# EAGLE schematic Schematic_BG96_Mega2560 (EAGLE 9.5.2)
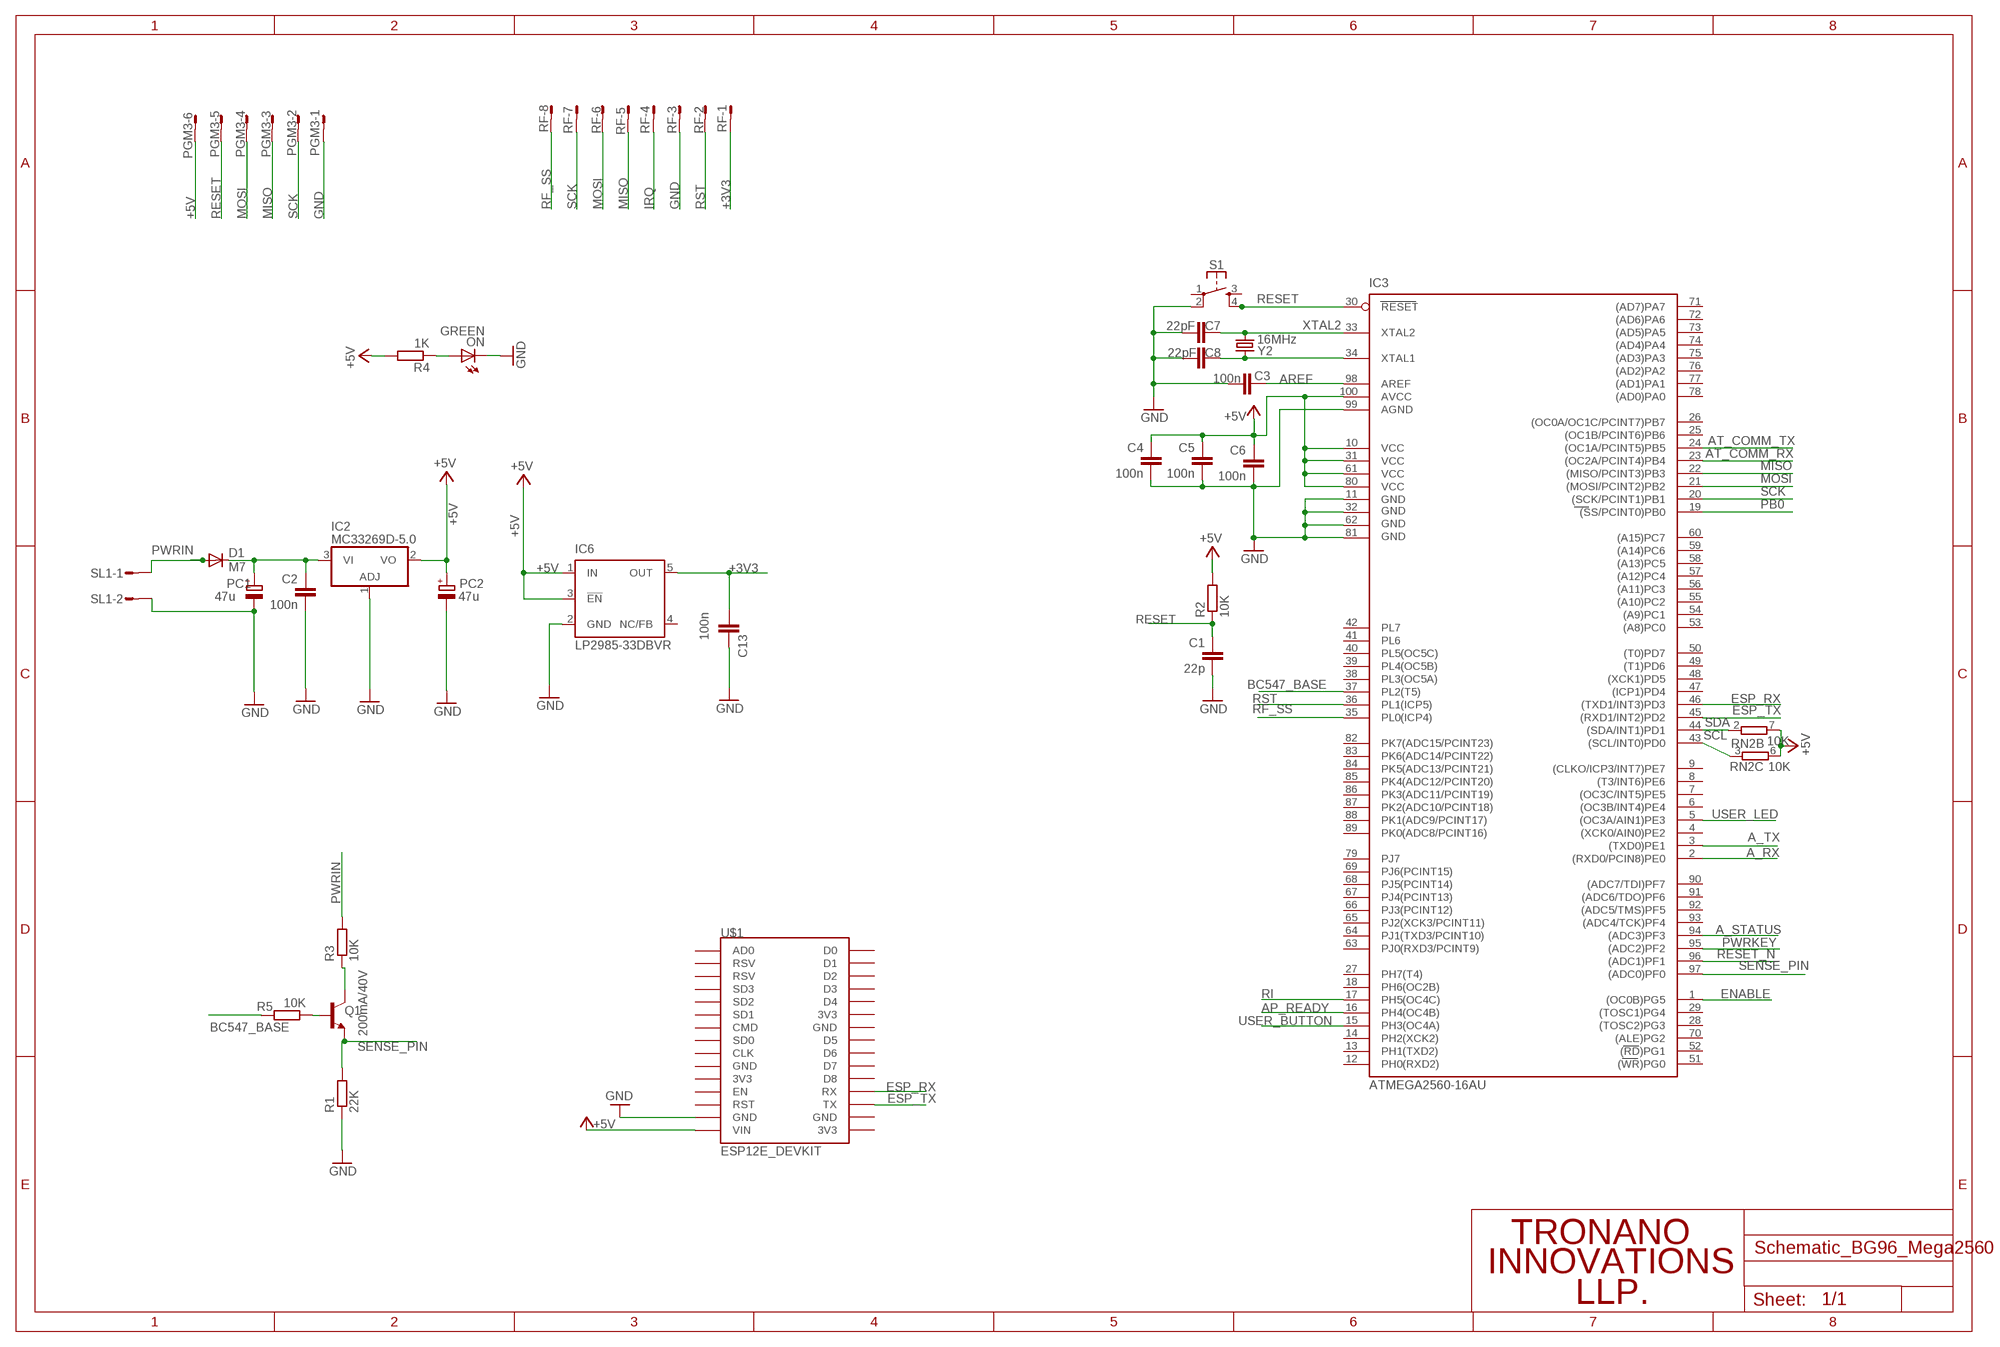
[diagram p0: schematic, sheet 1, part 1 of 2]
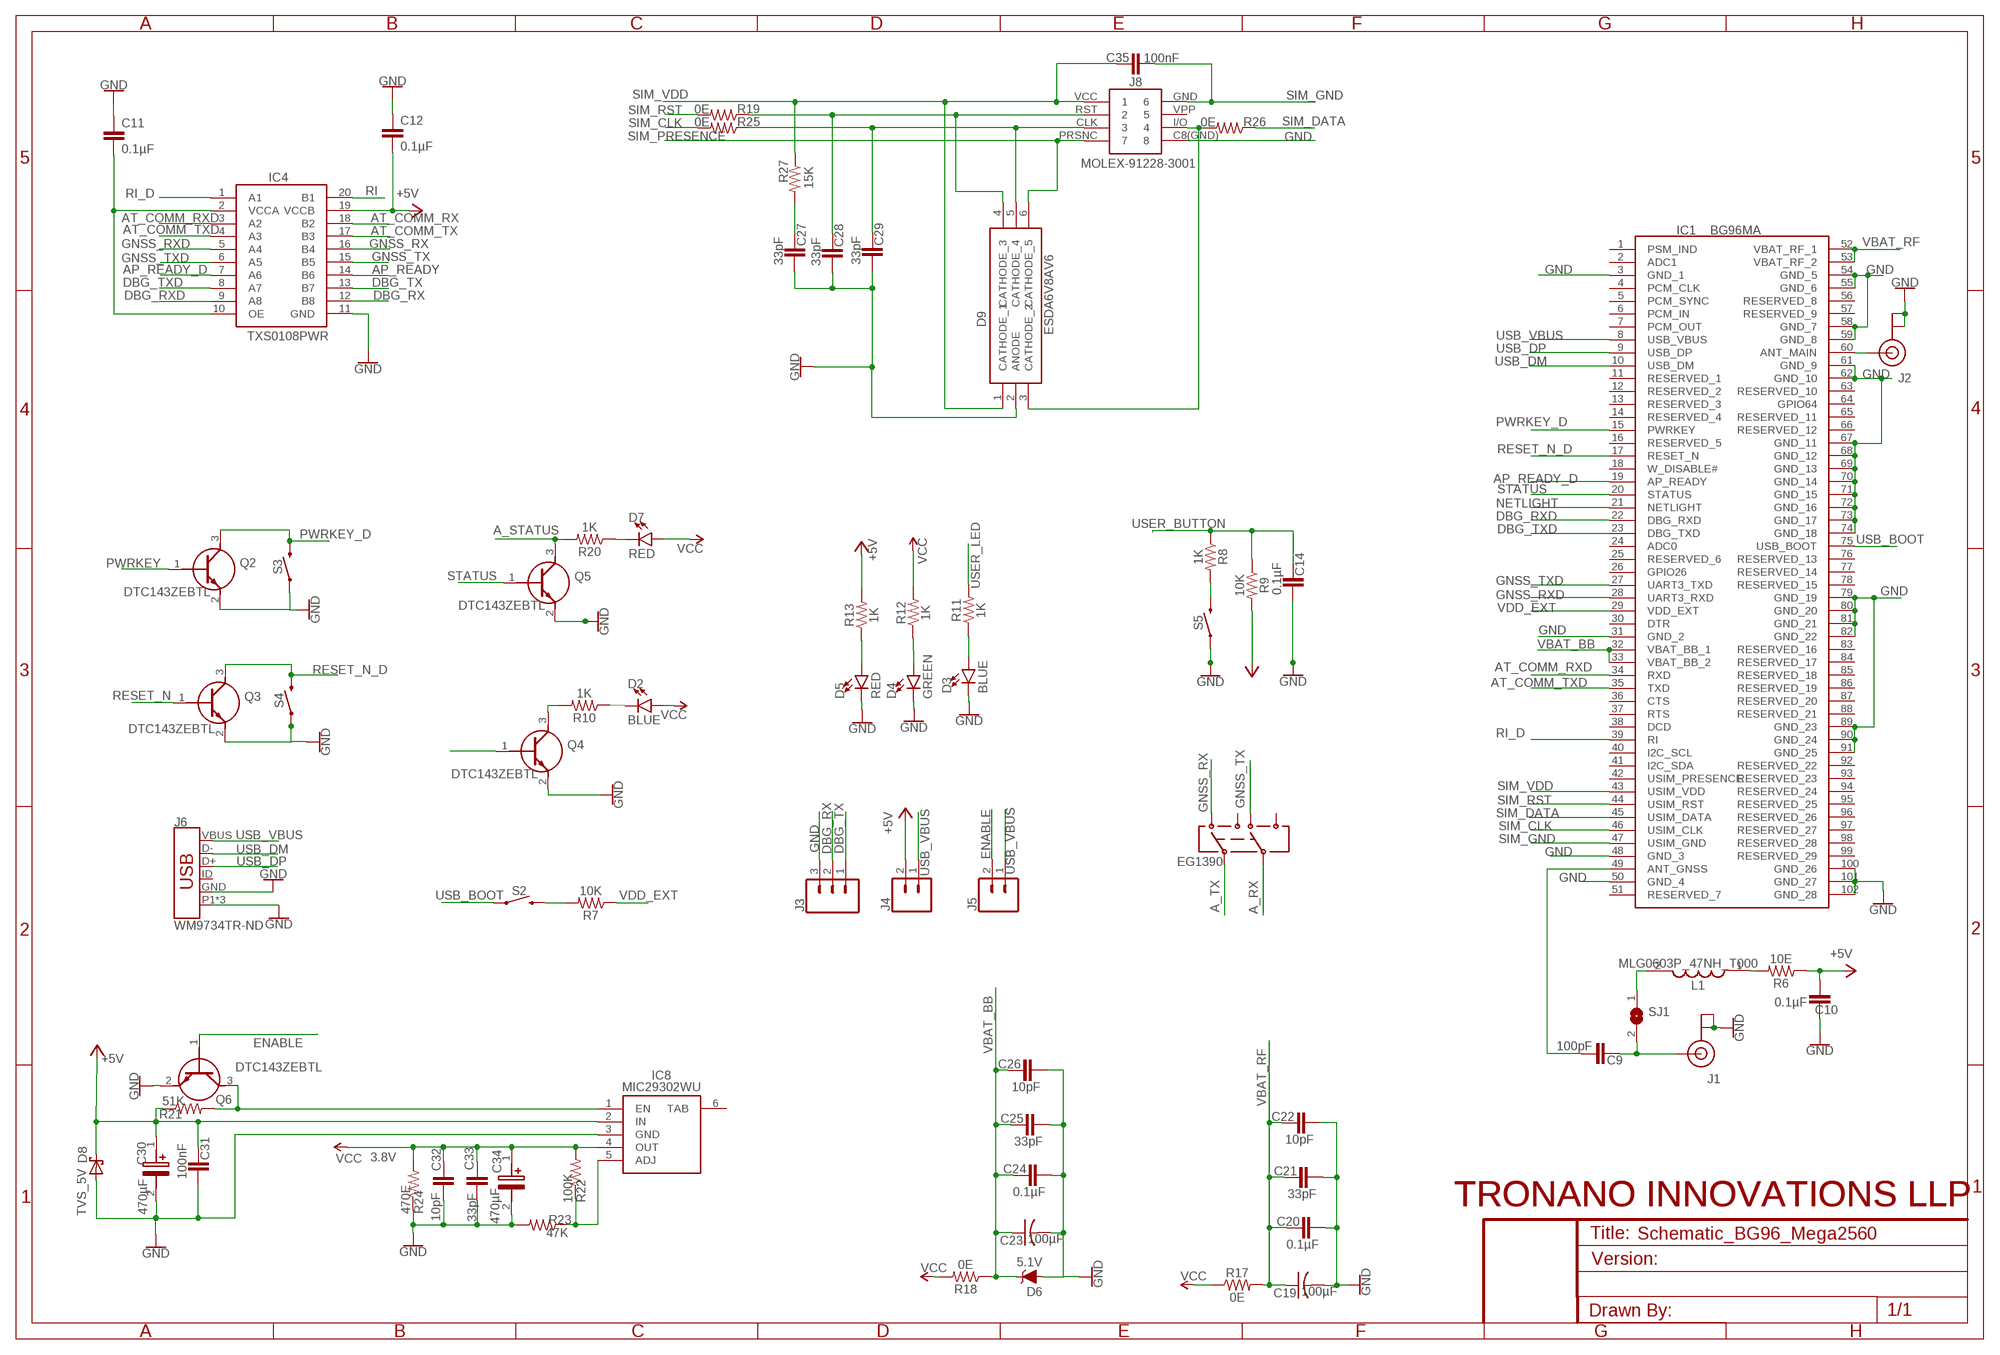
[diagram p1: schematic, sheet 1, part 2 of 2]

## Parts
C1  22p  C-EUC0805  [C0805]
C2  100n  C-EUC0805  [C0805]
C3  100n  C-EUC0805  [C0805]
C4  100n  C-EUC0805  [C0805]
C5  100n  C-EUC0805  [C0805]
C6  100n  C-EUC0805  [C0805]
C7  22pF  C-EUC0805  [C0805]
C8  22pF  C-EUC0805  [C0805]
C9  100pF  0.33UF/330NF-0805-50V-10%  [0805]
C10  0.1µF  0.33UF/330NF-0805-50V-10%  [0805]
C11  0.1µF  0.33UF/330NF-0805-50V-10%  [0805]
C12  0.1µF  0.33UF/330NF-0805-50V-10%  [0805]
C13  100n  C-EUC0805  [C0805]
C14  0.1µF  0.33UF/330NF-0805-50V-10%  [0805]
C19  100µF  C-USC0805K  [C0805K]
C20  0.1µF  0.33UF/330NF-0805-50V-10%  [0805]
C21  33pF  0.33UF/330NF-0805-50V-10%  [0805]
C22  10pF  0.33UF/330NF-0805-50V-10%  [0805]
C23  100µF  C-USC0805K  [C0805K]
C24  0.1µF  0.33UF/330NF-0805-50V-10%  [0805]
C25  33pF  0.33UF/330NF-0805-50V-10%  [0805]
C26  10pF  0.33UF/330NF-0805-50V-10%  [0805]
C27  33pF  0.33UF/330NF-0805-50V-10%  [0805]
C28  33pF  0.33UF/330NF-0805-50V-10%  [0805]
C29  33pF  0.33UF/330NF-0805-50V-10%  [0805]
C30  470µF  T495D477M006ATE0457280  [CAPPM7343X310N]
C31  100nF  0.33UF/330NF-0805-50V-10%  [0805]
C32  10pF  0.33UF/330NF-0805-50V-10%  [0805]
C33  33pF  0.33UF/330NF-0805-50V-10%  [0805]
C34  470µF  T495D477M006ATE0457280  [CAPPM7343X310N]
C35  100nF  0.33UF/330NF-0805-50V-10%  [0805]
D1  M7  DIODE-SMB  [SMB]
D2  BLUE  LED-BLUE1206  [LED-1206]
D3  BLUE  LED-BLUE1206  [LED-1206]
D4  GREEN  LED-BLUE1206  [LED-1206]
D5  RED  LED-BLUE1206  [LED-1206]
D6  5.1V  DIODE-ZENER-MMSZ5232BS  [SOD-323]
D7  RED  LED-BLUE1206  [LED-1206]
D8  TVS_5V  SMF5.0AT1G  [SOD123FL]
D9  ESDA6V8AV6  [SOTFL50P160X60-6N]
EG1390  SWITCH-DPDT-SMD-AYZ0202  [SWITCH_DPDT_SMD_AYZ0202]
IC1  BG96MA  [BG96MA]
IC2  MC33269D-5.0  [DPACK]
IC3  ATMEGA2560-16AU  ATMEGA1280-16AU  [TQFP100]
IC4  TXS0108PWR  TXB0108PWR  [SOP65P640X120-20N]
IC6  LP2985-33DBVR  TPS77033  [SOT23-DBV]
IC8  MIC29302WU  [6-PIN-TO-263]
J1  U.FL  [U.FL]
J2  U.FL  [U.FL]
J3  CONN_03LOCK  [1X03_LOCK]
J4  CONN_02  [1X02]
J5  CONN_02  [1X02]
J6  WM9734TR-ND  USB_MICRO-B_FEMALE-SMT-VERT  [USB-B-MICRO-SMD_VERT]
J8  MOLEX-91228-3001  [MOLEX-912283001]
L1  MLG0603P_47NH_T000  MLG0603P47NHT000  [INDC0603X33N]
ON  GREEN  LEDCHIPLED_1206  [CHIPLED_1206]
PC1  47u  CPOL-EUD  [PANASONIC_D]
PC2  47u  CPOL-EUD  [PANASONIC_D]
PGM3  S06P  [S06P]
Q1  200mA/40V  TRANS_NPN-2N3904-EZ  [TO-92-EZ]
Q2  DTC143ZEBTL  [SOTFL50P160X85-3N]
Q3  DTC143ZEBTL  [SOTFL50P160X85-3N]
Q4  DTC143ZEBTL  [SOTFL50P160X85-3N]
Q5  DTC143ZEBTL  [SOTFL50P160X85-3N]
Q6  DTC143ZEBTL  [SOTFL50P160X85-3N]
R1  22K  R-EU_R0805W  [R0805W]
R2  10K  R-EU_R0805  [R0805]
R3  10K  R-EU_R0805W  [R0805W]
R4  1K  R-EU_R0805  [R0805]
R5  10K  R-EU_R0805W  [R0805W]
R6  10E  0.3OHM-0805-1/8W-1%  [0805]
R7  10K  0.3OHM-0805-1/8W-1%  [0805]
R8  1K  0.3OHM-0805-1/8W-1%  [0805]
R9  10K  0.3OHM-0805-1/8W-1%  [0805]
R10  1K  0.3OHM-0805-1/8W-1%  [0805]
R11  1K  0.3OHM-0805-1/8W-1%  [0805]
R12  1K  0.3OHM-0805-1/8W-1%  [0805]
R13  1K  0.3OHM-0805-1/8W-1%  [0805]
R17  0E  0.3OHM-0805-1/8W-1%  [0805]
R18  0E  0.3OHM-0805-1/8W-1%  [0805]
R19  0E  0.3OHM-0805-1/8W-1%  [0805]
R20  1K  0.3OHM-0805-1/8W-1%  [0805]
R21  51K  0.3OHM-0805-1/8W-1%  [0805]
R22  100K  0.3OHM-0805-1/8W-1%  [0805]
R23  47K  0.3OHM-0805-1/8W-1%  [0805]
R24  470E  0.3OHM-0805-1/8W-1%  [0805]
R25  0E  0.3OHM-0805-1/8W-1%  [0805]
R26  0E  0.3OHM-0805-1/8W-1%  [0805]
R27  15K  0.3OHM-0805-1/8W-1%  [0805]
RF  S08P  [S08P]
RN2  10K  4R-NCAT16  [CAT16]
S1  MOMENTARY-SWITCH-SPST-2-SMD-5.2MM-TALL  [TACTILE_SWITCH_SMD_5.2MM]
S2  MOMENTARY-SWITCH-SPST-SMD-6.2MM-TALL  [TACTILE_SWITCH_SMD_6.2MM_TALL]
S3  MOMENTARY-SWITCH-SPST-SMD-6.2MM-TALL  [TACTILE_SWITCH_SMD_6.2MM_TALL]
S4  MOMENTARY-SWITCH-SPST-SMD-6.2MM-TALL  [TACTILE_SWITCH_SMD_6.2MM_TALL]
S5  MOMENTARY-SWITCH-SPST-SMD-6.2MM-TALL  [TACTILE_SWITCH_SMD_6.2MM_TALL]
SJ1  SJ  [SJ]
SL1  M02S  [02P]
U$1  ESP12E_DEVKIT  [ESP12E_DEVKIT]
Y2  16MHz  CRYSTAL-16MHZPTH-HC49US  [HC49US]

## Nets
3.8V: C32.1 C33.1 C34.1(+) IC8.4(OUT) R22.2 R24.2 ; supply symbol labelled VCC
+3V3: C13.2 IC6.5(OUT) RF.1
+5V: C4.1 C5.1 C6.1 C10.1 C12.2 C30.1(+) C31.1 D8.C IC2.2(VO) IC3.10(VCC) IC3.31(VCC1) IC3.61(VCC2) IC3.80(VCC3) IC3.100(AVCC) IC4.19(VCCB) IC6.1(IN) IC6.3(!EN) IC8.2(IN) J4.2 PC2.+ PGM3.6 R2.2 R4.2 R6.1 R9.2 R13.2 R21.1 RN2.6 RN2.7 U$1.VIN
A_RX: EG1390.5 IC3.2((RXD0/PCIN8)PE0)
A_STATUS: IC3.94((ADC3)PF3) Q5.3(C) R20.2
A_TX: EG1390.2 IC3.3((TXD0)PE1)
AP_READY: IC3.16(PH4(OC4B)) IC4.14(B6)
AP_READY_D: IC1.19(AP_READY) IC4.7(A6)
AREF: C3.1 IC3.98(AREF)
AT_COMM_RX: IC3.23((OC2A/PCINT4)PB4) IC4.18(B2)
AT_COMM_RXD: IC1.34(RXD) IC4.3(A2)
AT_COMM_TX: IC3.24((OC1A/PCINT5)PB5) IC4.17(B3)
AT_COMM_TXD: IC1.35(TXD) IC4.4(A3)
BC547_BASE: IC3.37(PL2(T5)) R5.2
DBG_RX: IC4.12(B8) J3.2
DBG_RXD: IC1.22(DBG_RXD) IC4.9(A8)
DBG_TX: IC4.13(B7) J3.1
DBG_TXD: IC1.23(DBG_TXD) IC4.8(A7)
ENABLE: IC3.1((OC0B)PG5) J5.2 Q6.1(B)
ESP_RX: IC3.46((TXD1/INT3)PD3) U$1.RX
ESP_TX: IC3.45((RXD1/INT2)PD2) U$1.TX
GND: C1.2 C2.2 C3.2 C4.2 C5.2 C6.2 C7.2 C8.2 C10.2 C11.1 C12.1 C13.1 C14.2 C19.2 C20.2 C21.2 C22.2 C23.2 C24.2 C25.2 C26.2 C27.2 C28.2 C29.2 C30.2(-) C31.2 C32.2 C33.2 C34.2(-) D3.C D4.C D5.C D6.A D8.A D9.2(ANODE) IC1.3(GND_1) IC1.31(GND_2) IC1.48(GND_3) IC1.50(GND_4) IC1.54(GND_5) IC1.55(GND_6) IC1.58(GND_7) IC1.59(GND_8) IC1.61(GND_9) IC1.62(GND_10) IC1.67(GND_11) IC1.68(GND_12) IC1.69(GND_13) IC1.70(GND_14) IC1.71(GND_15) IC1.72(GND_16) IC1.73(GND_17) IC1.74(GND_18) IC1.79(GND_19) IC1.80(GND_20) IC1.81(GND_21) IC1.82(GND_22) IC1.89(GND_23) IC1.90(GND_24) IC1.91(GND_25) IC1.100(GND_26) IC1.101(GND_27) IC1.102(GND_28) IC2.1(ADJ) IC3.11(GND) IC3.32(GND1) IC3.62(GND2) IC3.81(GND3) IC3.99(AGND) IC4.11(GND) IC6.2(GND) IC8.3(GND) J1.1(GND) J1.2(GND) J2.1(GND) J2.2(GND) J3.3 J6.GND J6.P1(SHIELD) J6.P2(SHIELD) J6.P3(SHIELD) J8.C8(GND) ON.C PC1.- PC2.- PGM3.1 Q2.2(E) Q3.2(E) Q4.2(E) Q5.2(E) Q6.2(E) R1.1 R23.2 R24.1 RF.3 S1.2 S3.A2 S4.A2 S5.A2 SL1.2 U$1.GND@1(GND)
GNSS_RX: EG1390.1 IC4.16(B4)
GNSS_RXD: IC1.28(UART3_RXD) IC4.5(A4)
GNSS_TX: EG1390.4 IC4.15(B5)
GNSS_TXD: IC1.27(UART3_TXD) IC4.6(A5)
IRQ: RF.4
MISO: IC3.22((MISO/PCINT3)PB3) PGM3.3 RF.5
MOSI: IC3.21((MOSI/PCINT2)PB2) PGM3.4 RF.6
N$1: Q1.2(B) R5.1
N$2: Q1.3(C) R3.1
N$3: ON.A R4.1
N$4: IC8.5(ADJ) R22.1 R23.1
N$5: IC8.1(EN) Q6.3(C) R21.2
N$6: C28.1 D9.4(CATHODE_3) J8.RST R19.1
N$7: C29.1 D9.5(CATHODE_4) J8.CLK R25.1
N$9: L1.2 SJ1.1
N$10: IC1.60(ANT_MAIN) J2.FEED(SIGNAL)
N$11: C9.2 IC1.49(ANT_GNSS)
N$12: C9.1 J1.FEED(SIGNAL) SJ1.2
N$13: D9.3(CATHODE_2) J8.I/O R26.2
N$14: L1.1 R6.2
N$15: C27.1 R27.2
N$16: C11.2 IC4.2(VCCA) IC4.10(OE)
N$17: R7.2 S2.B2
N$18: R8.2 S5.B2
N$19: Q4.3(C) R10.2
N$20: D2.C R10.1
N$21: D3.A R11.1
N$22: D4.A R12.1
N$23: D5.A R13.1
N$28: D7.C R20.1
NETLIGHT: IC1.21(NETLIGHT)
NETLIGHT1: Q4.1(B)
PB0: IC3.19((SS/PCINT0)PB0)
PWRIN: D1.A R3.2 SL1.1
PWRKEY: IC3.95((ADC2)PF2) Q2.1(B)
PWRKEY_D: IC1.15(PWRKEY) Q2.3(C) S3.B2
RESET: C1.1 IC3.30(RESET) PGM3.5 R2.1 S1.4
RESET_N: IC3.96((ADC1)PF1) Q3.1(B)
RESET_N_D: IC1.17(RESET_N) Q3.3(C) S4.B2
RF_SS: IC3.35(PL0(ICP4)) RF.8
RI: IC3.17(PH5(OC4C)) IC4.20(B1)
RI_D: IC1.39(RI) IC4.1(A1)
RST: IC3.36(PL1(ICP5)) RF.2
SCK: IC3.20((SCK/PCINT1)PB1) PGM3.2 RF.7
SCL: IC3.43((SCL/INT0)PD0) RN2.3
SDA: IC3.44((SDA/INT1)PD1) RN2.2
SENSE_PIN: IC3.97((ADC0)PF0) Q1.1(E) R1.2
SIM_CLK: IC1.46(USIM_CLK) R25.2
SIM_DATA: IC1.45(USIM_DATA) R26.1
SIM_GND: C35.2 IC1.47(USIM_GND) J8.GND
SIM_PRESENCE: D9.6(CATHODE_5) J8.PRSNC
SIM_RST: IC1.44(USIM_RST) R19.2
SIM_VDD: C35.1 D9.1(CATHODE_1) IC1.43(USIM_VDD) J8.VCC R27.1
STATUS: IC1.20(STATUS) Q5.1(B)
USB_BOOT: IC1.75(USB_BOOT) S2.A2
USB_DM: IC1.10(USB_DM) J6.D-
USB_DP: IC1.9(USB_DP) J6.D+
USB_VBUS: IC1.8(USB_VBUS) J4.1 J5.1 J6.VBUS
USER_BUTTON: C14.1 IC3.15(PH3(OC4A)) R8.1 R9.1
USER_LED: IC3.5((OC3A/AIN1)PE3) R11.2
VBAT_BB: C23.1 C24.1 C25.1 C26.1 D6.C IC1.32(VBAT_BB_1) IC1.33(VBAT_BB_2) R18.1
VBAT_RF: C19.1 C20.1 C21.1 C22.1 IC1.52(VBAT_RF_1) IC1.53(VBAT_RF_2) R17.2
VCC: D2.A D7.A R12.2 R17.1 R18.2
VDD_EXT: IC1.29(VDD_EXT) R7.1
VIN1: C2.1 D1.C IC2.3(VI) PC1.+
XTAL1R: C8.1 IC3.34(XTAL1) Y2.2
XTAL2: C7.1 IC3.33(XTAL2) Y2.1
Unconnected: EG1390.3 EG1390.6 IC1.1(PSM_IND) IC1.2(ADC1) IC1.4(PCM_CLK) IC1.5(PCM_SYNC) IC1.6(PCM_IN) IC1.7(PCM_OUT) IC1.11(RESERVED_1) IC1.12(RESERVED_2) IC1.13(RESERVED_3) IC1.14(RESERVED_4) IC1.16(RESERVED_5) IC1.18(W_DISABLE#) IC1.24(ADC0) IC1.25(RESERVED_6) IC1.26(GPIO26) IC1.30(DTR) IC1.36(CTS) IC1.37(RTS) IC1.38(DCD) IC1.40(I2C_SCL) IC1.41(I2C_SDA) IC1.42(USIM_PRESENCE) IC1.51(RESERVED_7) IC1.56(RESERVED_8) IC1.57(RESERVED_9) IC1.63(RESERVED_10) IC1.64(GPIO64) IC1.65(RESERVED_11) IC1.66(RESERVED_12) IC1.76(RESERVED_13) IC1.77(RESERVED_14) IC1.78(RESERVED_15) IC1.83(RESERVED_16) IC1.84(RESERVED_17) IC1.85(RESERVED_18) IC1.86(RESERVED_19) IC1.87(RESERVED_20) IC1.88(RESERVED_21) IC1.92(RESERVED_22) IC1.93(RESERVED_23) IC1.94(RESERVED_24) IC1.95(RESERVED_25) IC1.96(RESERVED_26) IC1.97(RESERVED_27) IC1.98(RESERVED_28) IC1.99(RESERVED_29) IC3.4((XCK0/AIN0)PE2) IC3.6((OC3B/INT4)PE4) IC3.7((OC3C/INT5)PE5) IC3.8((T3/INT6)PE6) IC3.9((CLKO/ICP3/INT7)PE7) IC3.12(PH0(RXD2)) IC3.13(PH1(TXD2)) IC3.14(PH2(XCK2)) IC3.18(PH6(OC2B)) IC3.25((OC1B/PCINT6)PB6) IC3.26((OC0A/OC1C/PCINT7)PB7) IC3.27(PH7(T4)) IC3.28((TOSC2)PG3) IC3.29((TOSC1)PG4) IC3.38(PL3(OC5A)) IC3.39(PL4(OC5B)) IC3.40(PL5(OC5C)) IC3.41(PL6) IC3.42(PL7) IC3.47((ICP1)PD4) IC3.48((XCK1)PD5) IC3.49((T1)PD6) IC3.50((T0)PD7) IC3.51((WR)PG0) IC3.52((RD)PG1) IC3.53((A8)PC0) IC3.54((A9)PC1) IC3.55((A10)PC2) IC3.56((A11)PC3) IC3.57((A12)PC4) IC3.58((A13)PC5) IC3.59((A14)PC6) IC3.60((A15)PC7) IC3.63(PJ0(RXD3/PCINT9)) IC3.64(PJ1(TXD3/PCINT10)) IC3.65(PJ2(XCK3/PCINT11)) IC3.66(PJ3(PCINT12)) IC3.67(PJ4(PCINT13)) IC3.68(PJ5(PCINT14)) IC3.69(PJ6(PCINT15)) IC3.70((ALE)PG2) IC3.71((AD7)PA7) IC3.72((AD6)PA6) IC3.73((AD5)PA5) IC3.74((AD4)PA4) IC3.75((AD3)PA3) IC3.76((AD2)PA2) IC3.77((AD1)PA1) IC3.78((AD0)PA0) IC3.79(PJ7) IC3.82(PK7(ADC15/PCINT23)) IC3.83(PK6(ADC14/PCINT22)) IC3.84(PK5(ADC13/PCINT21)) IC3.85(PK4(ADC12/PCINT20)) IC3.86(PK3(ADC11/PCINT19)) IC3.87(PK2(ADC10/PCINT18)) IC3.88(PK1(ADC9/PCINT17)) IC3.89(PK0(ADC8/PCINT16)) IC3.90((ADC7/TDI)PF7) IC3.91((ADC6/TDO)PF6) IC3.92((ADC5/TMS)PF5) IC3.93((ADC4/TCK)PF4) IC6.4(NC/FB) IC8.6(TAB) J6.ID J8.VPP RN2.1 RN2.4 RN2.5 RN2.8 S1.1 S1.3 U$1.3V3@0(3V3) U$1.3V3@1(3V3) U$1.3V3@2(3V3) U$1.AD0 U$1.CLK U$1.CMD U$1.D0 U$1.D1 U$1.D2 U$1.D3 U$1.D4 U$1.D5 U$1.D6 U$1.D7 U$1.D8 U$1.EN U$1.GND@0(GND) U$1.GND@2(GND) U$1.GND@3(GND) U$1.RST U$1.RSV@0(RSV) U$1.RSV@1(RSV) U$1.SD0 U$1.SD1 U$1.SD2 U$1.SD3

## Notes on the sheet
- TRONANO
- INNOVATIONS
- LLP.
- TRONANO INNOVATIONS LLP | TRONANO INNOVATIONS LLP

## Library data of the parts
C1-C6 C13 = SmartPrj:C-EU: CAPACITOR, European symbol
C7 C8 = rcl:C-EU: CAPACITOR, European symbol; SPICEPREFIX: C
C9-C12 C14 C20-C22 C24-C29 C31-C33 C35 = SparkFun-Capacitors:0.33UF/330NF: 0.33µF/330nF ceramic capacitors A capacitor is a passive two-terminal electrical component used to store electrical energy temporarily in an electric field.; PROD_ID: CAP-08469; VALUE: 0.33µF
C19 C23 = rcl:C-US: CAPACITOR, American symbol; SPICEPREFIX: C
C30 C34 = SamacSys_Parts:T495D477M006ATE0457280: Tantalum Capacitors - Solid SMD 6.3V 470uF 20% ESR=45mOhms Source: Datasheet <https://componentsearchengine.com/Datasheets/1/T495D477M006ATE0457280.pdf>; DESCRIPTION: Tantalum Capacitors - Solid SMD 6.3V 470uF 20% ESR=45mOhms; HEIGHT: 3.1mm; MANUFACTURER_NAME: Kemet; MANUFACTURER_PART_NUMBER: T495D477M006ATE0457280; MOUSER_PART_NUMBER: 80-T495D477M06ATE045; MOUSER_PRICE-STOCK: https://www.mouser.com/Search/Refine.aspx?Keyword=80-T495D477M06ATE045
D1 = diode:DIODE-: DIODE
D2 D3 = SparkFun-LED:LED-BLUE: Blue SMD LED Used in manufacturing of various products at SparkFun Packages: 0603 - SMD 0603 package [Product Link] <http://www.digikey.com/product-detail/en/SMLE12BC7TT86/511-1589-2-ND/1641808> 1206 - SMD1206 package [Product Link] <http://www.digikey.com/product-detail/en/lite-on-inc/LTST-C150TBKT/160-1643-1-ND/573584> SparkFun Products: ESP8266 Thing-Dev Board <https://www.sparkfun.com/products/13711> RedBoard <https://www.sparkfun.com/products/12757>; PROD_ID: DIO-09911
D4 D5 D7 = SparkFun-LED:LED-BLUE: Blue SMD LED Used in manufacturing of various products at SparkFun Packages: 0603 - SMD 0603 package [Product Link] <http://www.digikey.com/product-detail/en/SMLE12BC7TT86/511-1589-2-ND/1641808> 1206 - SMD1206 package [Product Link] <http://www.digikey.com/product-detail/en/lite-on-inc/LTST-C150TBKT/160-1643-1-ND/573584> SparkFun Products: ESP8266 Thing-Dev Board <https://www.sparkfun.com/products/13711> RedBoard <https://www.sparkfun.com/products/12757>; PROD_ID: DIO-09911; VALUE: BLUE
D6 = SparkFun-DiscreteSemi:DIODE-ZENER: Zener Diode A Zener diode allows current to flow from its anode to its cathode like a normal semiconductor diode, but it also permits current to flow in the reverse direction when its "Zener voltage" is reached. - WIkipedia; PROD_ID: DIO-12442; VALUE: 5.6V
D8 = TVS_Diode:SMF5.0AT1G: 200 W Transient Voltage Suppressor Source: Data sheet <http://www.onsemi.com/pub_link/Collateral/SMF5.0AT1G-D.PDF>; AVAILABILITY: Unavailable; DESCRIPTION: 9.2V Clamp 21.7A Ipp Tvs Diode Surface Mount SOD-123FL; MF: Littelfuse; MP: SMF5.0AT1G; PACKAGE: SOD-123 Littelfuse; PRICE: None
D9 = SamacSys_Parts:ESDA6V8AV6: ESDA6V8AV6 Low Junction Capacitance Transient Voltage Suppressors for ESD Protection Source: Datasheet <http://www.chinesechip.com/files/2015-06/c6e5fabb-2b46-4fb6-8cff-c88a4d044cb1.pdf>; DESCRIPTION: ESDA6V8AV6 Low Junction Capacitance Transient Voltage Suppressors for ESD Protection; HEIGHT: 0.6mm; MANUFACTURER_NAME: Will Semiconductor; MANUFACTURER_PART_NUMBER: ESDA6V8AV6
EG1390 = SparkFun-Switches:SWITCH-DPDT: Double-Pole, Double-Throw (DPDT) Switch Double-pole, double-throw switches. Variant Overview PTH-GPI-152-3013 Used on SparkFun Geiger Counter <https://www.sparkfun.com/products/11345> SMD-AY0202 Surface Mount DPDT Switch <https://www.sparkfun.com/products/597> (COM-00597) Used on e.g. LilyPad Arduino USB - ATmega32U4 Board <https://www.sparkfun.com/products/12049>; PROD_ID: SWCH-08179; SF_SKU: COM-00597
IC1 = BG96MA:BG96MA: LTE Module Source: Datasheet <http://www.quectel.com/product/bg96.htm>; DESCRIPTION: LTE Module; HEIGHT: 2mm; MANUFACTURER_NAME: Quectel; MANUFACTURER_PART_NUMBER: BG96MA
IC2 = linear:MC33269?*: Adjustable Output Low Dropout Voltage Regulator 800 mA Source: http://www.onsemi.com/pub/Collateral/MC33269-D.PDF
IC3 = atmel-2005:ATMEGA*: MICROCONTROLLER 64/128/256 Kbytes FLASH 4 Kbytes EEPROM 8 Kbytes SRAM 86 General Purpose I/O pins 12-channels16-bit PWM 4 x Serial USARTs 16-channels 10-bit A/D
IC4 = SamacSys_Parts:TXB0108PWR: 8-Bit Bidirectional Voltage-Level Shifter with Auto Direction Sensing and +/-15-kV ESD Protect Source: Datasheet <http://www.ti.com/lit/ds/symlink/txb0108.pdf>; DESCRIPTION: 8-Bit Bidirectional Voltage-Level Shifter with Auto Direction Sensing and +/-15-kV ESD Protect; HEIGHT: 1.2mm; MANUFACTURER_NAME: Texas Instruments; MANUFACTURER_PART_NUMBER: TXB0108PWR; MOUSER_PART_NUMBER: 595-TXB0108PWR; MOUSER_PRICE-STOCK: https://www.mouser.com/Search/Refine.aspx?Keyword=595-TXB0108PWR; RS_PART_NUMBER: 7094614P; RS_PRICE-STOCK: http://uk.rs-online.com/web/p/products/7094614P
IC6 = texas:TPS770*: ULTRALOW-POWER 50-mA LOW-DROPOUT LINEAR REGULATORS 50-mA Low-Dropout Regulator Source: http://focus.ti.com/lit/ds/symlink/tps77001.pdf
IC8 = SamacSys_Parts:MIC29302WU: 3.0A LDO Adj. + Shutdown, MIC29302WU Micrel MIC29302WU, LDO Voltage Regulator, Adjustable 3A, 1.25 26 V +/-1%, 6-Pin TO-263 Source: Datasheet <https://componentsearchengine.com/Datasheets/1/MIC29302WU.pdf>; DESCRIPTION: 3.0A LDO Adj. + Shutdown, MIC29302WU Micrel MIC29302WU, LDO Voltage Regulator, Adjustable 3A, 1.25 26 V +/-1%, 6-Pin TO-263; HEIGHT: mm; MANUFACTURER_NAME: Microchip; MANUFACTURER_PART_NUMBER: MIC29302WU; MOUSER_PART_NUMBER: 998-MIC29302WU; MOUSER_PRICE-STOCK: https://www.mouser.com/Search/Refine.aspx?Keyword=998-MIC29302WU
J1 J2 = SparkFun-Connectors:U.FL: SMD Antenna Connector - U.FL 2mm height, 3.0mm x 3.0mm receptacle size. SparkFun Products: SparkFun WiFi Shield - ESP8266 <https://www.sparkfun.com/products/13287> SparkFun ESP8266 Thing <https://www.sparkfun.com/products/13231> SparkFun MiniGen - Pro Mini Signal Generator Shield <https://www.sparkfun.com/products/11420>; PROD_ID: CONN-09193; SF_ID: WRL-09144
J3 = SparkFun-Connectors:CONN_03: Multi connection point. Often used as Generic Header-pin footprint for 0.1 inch spaced/style header connections On any of the 0.1 inch spaced packages, you can populate with these: Break Away Headers - Straight <https://www.sparkfun.com/products/116> (PRT-00116) Break Away Male Headers - Right Angle <https://www.sparkfun.com/products/553> (PRT-00553) Female Headers <https://www.sparkfun.com/products/115> (PRT-00115) Break Away Headers - Machine Pin <https://www.sparkfun.com/products/117> (PRT-00117) Break Away Female Headers - Swiss Machine Pin <https://www.sparkfun.com/products/743> (PRT-00743) Stackable Header - 3 Pin (Female, 0.1") <https://www.sparkfun.com/products/13875> (PRT-13875) For SCREWTERMINALS and SPRING TERMINALS visit here: Screw Terimnals on SparkFun.com <https://www.sparkfun.com/search/results?term=Screw+Terminals> (5mm/3.5mm/2.54mm spacing) This device is also useful as a general connection point to wire up your design to another part of your project. Our various solder wires solder well into these plated through hole pads. Hook-Up Wire - Assortment (Stranded, 22 AWG) <https://www.sparkfun.com/products/11375> (PRT-11375) Hook-Up Wire - Assortment (Solid Core, 22 AWG) <https://www.sparkfun.com/products/11367> (PRT-11367) View the entire wire category on our website here <https://www.sparkfun.com/categories/141> Special notes: Molex polarized connector foot print use with SKU : PRT-08232 with associated crimp pins and housings.
J4 J5 = SparkFun-Connectors:CONN_02: Multi connection point. Often used as Generic Header-pin footprint for 0.1 inch spaced/style header connections On any of the 0.1 inch spaced packages, you can populate with these: Break Away Headers - Straight <https://www.sparkfun.com/products/116> (PRT-00116) Break Away Male Headers - Right Angle <https://www.sparkfun.com/products/553> (PRT-00553) Female Headers <https://www.sparkfun.com/products/115> (PRT-00115) Break Away Headers - Machine Pin <https://www.sparkfun.com/products/117> (PRT-00117) Break Away Female Headers - Swiss Machine Pin <https://www.sparkfun.com/products/743> (PRT-00743) For SCREWTERMINALS and SPRING TERMINALS visit here: Screw Terimnals on SparkFun.com <https://www.sparkfun.com/search/results?term=Screw+Terminals> (5mm/3.5mm/2.54mm spacing) This device is also useful as a general connection point to wire up your design to another part of your project. Our various solder wires solder well into these plated through hole pads. Hook-Up Wire - Assortment (Stranded, 22 AWG) <https://www.sparkfun.com/products/11375> (PRT-11375) Hook-Up Wire - Assortment (Solid Core, 22 AWG) <https://www.sparkfun.com/products/11367> (PRT-11367) View the entire wire category on our website here <https://www.sparkfun.com/categories/141> Special notes: Molex polarized connector foot print use with: PRT-08233 with associated crimp pins and housings. 2.54_SCREWTERM for use with PRT-10571. 3.5mm Screw Terminal footprints for PRT-08084 5mm Screw Terminal footprints for use with PRT-08432
J6 = SparkFun-Connectors:USB_MICRO-B: USB Type Micro-B Connector Male/female and PTH/SMT variants SparkFun Products: SparkFun microB USB Breakout <https://www.sparkfun.com/products/12035> SparkFun USB microB Plug Breakout <https://www.sparkfun.com/products/10031> SparkFun ESP8266 Thing <https://www.sparkfun.com/products/13231>; PROD_ID: CONN-13534
J8 = SamacSys_Parts:MOLEX-91228-3001: 6 way SMT SIM card reader w/ejector 6 way SMT SIM card reader w/ejector Source: Datasheet <https://componentsearchengine.com/Datasheets/1/91228-3001.pdf>; DESCRIPTION: 6 way SMT SIM card reader w/ejector 6 way SMT SIM card reader w/ejector; HEIGHT: 3mm; MANUFACTURER_NAME: Molex; MANUFACTURER_PART_NUMBER: 91228-3001; MOUSER_PART_NUMBER: 538-91228-3001; MOUSER_PRICE-STOCK: https://www.mouser.com/Search/Refine.aspx?Keyword=538-91228-3001
L1 = SamacSys_Parts:MLG0603P47NHT000: FIXED IND 47NH 110MA 2.9 OHM SMD Source: Datasheet <https://componentsearchengine.com/Datasheets/1/MLG0603P47NHT000.pdf>; DESCRIPTION: FIXED IND 47NH 110MA 2.9 OHM SMD; HEIGHT: 0.33mm; MANUFACTURER_NAME: TDK; MANUFACTURER_PART_NUMBER: MLG0603P47NHT000; MOUSER_PART_NUMBER: 810-MLG0603P47NHT000; MOUSER_PRICE-STOCK: https://www.mouser.com/Search/Refine.aspx?Keyword=810-MLG0603P47NHT000
ON = led:LED: LED OSRAM: - CHIPLED LG R971, LG N971, LY N971, LG Q971, LY Q971, LO R971, LY R971 LH N974, LH R974 LS Q976, LO Q976, LY Q976 LO Q996 - Hyper CHIPLED LW Q18S LB Q993, LB Q99A, LB R99A - SideLED LS A670, LO A670, LY A670, LG A670, LP A670 LB A673, LV A673, LT A673, LW A673 LH A674 LY A675 LS A676, LA A676, LO A676, LY A676, LW A676 LS A679, LY A679, LG A679 - Hyper Micro SIDELED® LS Y876, LA Y876, LO Y876, LY Y876 LT Y87S - SmartLED LW L88C, LW L88S LB L89C, LB L89S, LG L890 LS L89K, LO L89K, LY L89K LS L896, LA L896, LO L896, LY L896 - TOPLED LS T670, LO T670, LY T670, LG T670, LP T670 LSG T670, LSP T670, LSY T670, LOP T670, LYG T670 LG T671, LOG T671, LSG T671 LB T673, LV T673, LT T673, LW T673 LH T674 LS T676, LA T676, LO T676, LY T676, LB T676, LH T676, LSB T676, LW T676 LB T67C, LV T67C, LT T67C, LS T67K, LO T67K, LY T67K, LW E67C LS E67B, LA E67B, LO E67B, LY E67B, LB E67C, LV E67C, LT E67C LW T67C LS T679, LY T679, LG T679 LS T770, LO T770, LY T770, LG T770, LP T770 LB T773, LV T773, LT T773, LW T773 LH T774 LS E675, LA E675, LY E675, LS T675 LS T776, LA T776, LO T776, LY T776, LB T776 LHGB T686 LT T68C, LB T68C - Hyper Mini TOPLED® LB M676 - Mini TOPLED Santana® LG M470 LS M47K, LO M47K, LY M47K Source: http://www.osram.convergy.de LUXEON: - LUMILED® LXK2-PW12-R00, LXK2-PW12-S00, LXK2-PW14-U00, LXK2-PW14-V00 LXK2-PM12-R00, LXK2-PM12-S00, LXK2-PM14-U00 LXK2-PE12-Q00, LXK2-PE12-R00, LXK2-PE12-S00, LXK2-PE14-T00, LXK2-PE14-U00 LXK2-PB12-K00, LXK2-PB12-L00, LXK2-PB12-M00, LXK2-PB14-N00, LXK2-PB14-P00, LXK2-PB14-Q00 LXK2-PR12-L00, LXK2-PR12-M00, LXK2-PR14-Q00, LXK2-PR14-R00 LXK2-PD12-Q00, LXK2-PD12-R00, LXK2-PD12-S00 LXK2-PH12-R00, LXK2-PH12-S00 LXK2-PL12-P00, LXK2-PL12-Q00, LXK2-PL12-R00 Source: www.luxeon.com KINGBRIGHT: KA-3528ASYC Source: www.kingbright.com
PC1 PC2 = rcl:CPOL-EU: POLARIZED CAPACITOR, European symbol
PGM3 = con-amp-mt:S06P: AMP MT CONNECTOR; OC_FARNELL: unknown; OC_NEWARK: unknown
Q1 = SparkFun-DiscreteSemi:TRANS_NPN: NPN transistor Current controlled devices typically used to amplify current or used as a switch. BC547 - COM-08928 <http://www.sparkfun.com/products/8928> (TO-92 45V 100mA) (1.Collector 2.Base 3.Emitter) 2N3904 - COM-00521 <http://www.sparkfun.com/products/521> (TO-92 40V 200mA) (1.Emitter 2.Base 3.Collector) P2N2222A - COM-12852 <http://www.sparkfun.com/products/12852> (TO-92 40V 600mA) (1.Collector 2.Base 3.Emitter); PROD_ID: TRANS-08447
Q2-Q6 = SamacSys_Parts:DTC143ZEBTL: ROHM, DTC143ZEBTL NPN Digital Transistor, 100 mA 50 V 4.7 k, Ratio Of 10, 3-Pin SC-89 Source: Datasheet <https://componentsearchengine.com/Datasheets/1/DTC143ZEBTL.pdf>; DESCRIPTION: ROHM, DTC143ZEBTL NPN Digital Transistor, 100 mA 50 V 4.7 k, Ratio Of 10, 3-Pin SC-89; HEIGHT: 0.85mm; MANUFACTURER_NAME: ROHM Semiconductor; MANUFACTURER_PART_NUMBER: DTC143ZEBTL; MOUSER_PART_NUMBER: 755-DTC143ZEBTL; MOUSER_PRICE-STOCK: https://www.mouser.com/Search/Refine.aspx?Keyword=755-DTC143ZEBTL
R1-R5 = rcl:R-EU_: RESISTOR, European symbol; SPICEPREFIX: R
R6-R13 R17-R27 = SparkFun-Resistors:0.3OHM: 0.3Ω resistor A resistor is a passive two-terminal electrical component that implements electrical resistance as a circuit element. Resistors act to reduce current flow, and, at the same time, act to lower voltage levels within circuits. - Wikipedia; PROD_ID: RES-11622; VALUE: 0.3
RF = con-amp-mt:S08P: AMP MT CONNECTOR; OC_FARNELL: unknown; OC_NEWARK: unknown
RN2 = resistor-dil:4R-N: Array Chip Resistor Source: RS Component / Phycomp
S1 = SparkFun-Switches:MOMENTARY-SWITCH-SPST-2: Momentary Switch (Pushbutton) - SPST - Two Circuits Normally-open (NO) SPST momentary switches (buttons, pushbuttons). Schematic symbol includes two switch circuits. Variants SMD-4.6MMX2.8MM - 4.60mm x 2.80mm Tactile Momentary Button Switch - Used on SparkFun SAMD21 Mini Breakout <https://www.sparkfun.com/products/13664> SMD-5.2MM - Mini Pushbutton Switch - SMD <https://www.sparkfun.com/products/8720> - Used on Arduino Pro Mini <https://www.sparkfun.com/products/11114>; PROD_ID: SWCH-14139
S2-S5 = SparkFun-Switches:MOMENTARY-SWITCH-SPST: Momentary Switch (Pushbutton) - SPST Normally-open (NO) SPST momentary switches (buttons, pushbuttons). Variants PTH-12MM - 12mm square, through-hole Momentary Pushbutton Switch - 12mm Square <https://www.sparkfun.com/products/9190> (COM-09190) PTH-6.0MM, PTH-6.0MM-KIT - 6.0mm square, through-hole Mini Pushbutton Switch <https://www.sparkfun.com/products/97> (COM-00097) KIT package intended for soldering kit's - only one side of pads' copper is exposed. PTH-RIGHT-ANGLE-KIT - Right-angle, through-hole Right Angle Tactile Button <https://www.sparkfun.com/products/10791> - Used on SparkFun BigTime Watch Kit <https://www.sparkfun.com/products/11734> SMD-12MM - 12mm square, surface-mount Tactile Button - SMD (12mm) <https://www.sparkfun.com/products/12993> (COM-12993) Used on SparkFun PicoBoard <https://www.sparkfun.com/products/11888> SMD-4.5MM - 4.5mm Square Trackball Switch Used on SparkFun Blackberry Trackballer Breakout <https://www.sparkfun.com/products/13169> SMD-4.6MMX2.8MM - 4.60mm x 2.80mm, surface mount Used on SparkFun SAMD21 Mini Breakout <https://www.sparkfun.com/products/13664> SMD-5.2MM, SMD-5.2-REDUNDANT - 5.2mm square, surface-mount Mini Pushbutton Switch - SMD <https://www.sparkfun.com/products/8720> (COM-08720) Used on Arduino Pro Mini <https://www.sparkfun.com/products/11114> REDUNDANT package connects both switch circuits together SMD-6.0X3.5MM - 6.0 x 3.5mm, surface mount Momentary Reset Switch SMD <https://www.sparkfun.com/products/8229> (COM-08229) SMD-6.2MM-TALL - 6.2mm square, surface mount Tactile Button - SMD (6mm) <https://www.sparkfun.com/products/12992> Used on SparkFun Digital Sandbox <https://www.sparkfun.com/products/12651> SMD-RIGHT-ANGLE - Right-angle, surface mount Used on SparkFun Block for Intel® Edison - Arduino <https://www.sparkfun.com/products/13036>; PROD_ID: SWCH-11966; SF_SKU: COM-12992
SJ1 = jumper:SJ: SMD solder JUMPER
SL1 = con-amp-quick:M02S: AMP QUICK CONNECTOR; OC_FARNELL: unknown; OC_NEWARK: unknown
U$1 = ESP12E_DEVKIT:ESP12E_DEVKIT: ESP12E DEVKIT BOARD
Y2 = SparkFun-Clocks:CRYSTAL-16MHZ: 16MHz Crystal Digikey Example <http://www.digikey.com/product-search/en?keywords=535-9122-1-ND> Frequency: 16MHz Frequency Stability: ±50ppm Frequency Tolerance: ±20ppm Load Capacitance: 18pF SparkFun Products: Pro Micro -5V/16MHz <https://www.sparkfun.com/products/12640> SparkFun Serial Enabled LCD Kit <https://www.sparkfun.com/products/10097>; PROD_ID: XTAL-08181; SF_ID: COM-00536